# EAGLE design mbedXdotShield-V_1_0_1 (EAGLE 7.6.0)

## Sheet 1 of 5
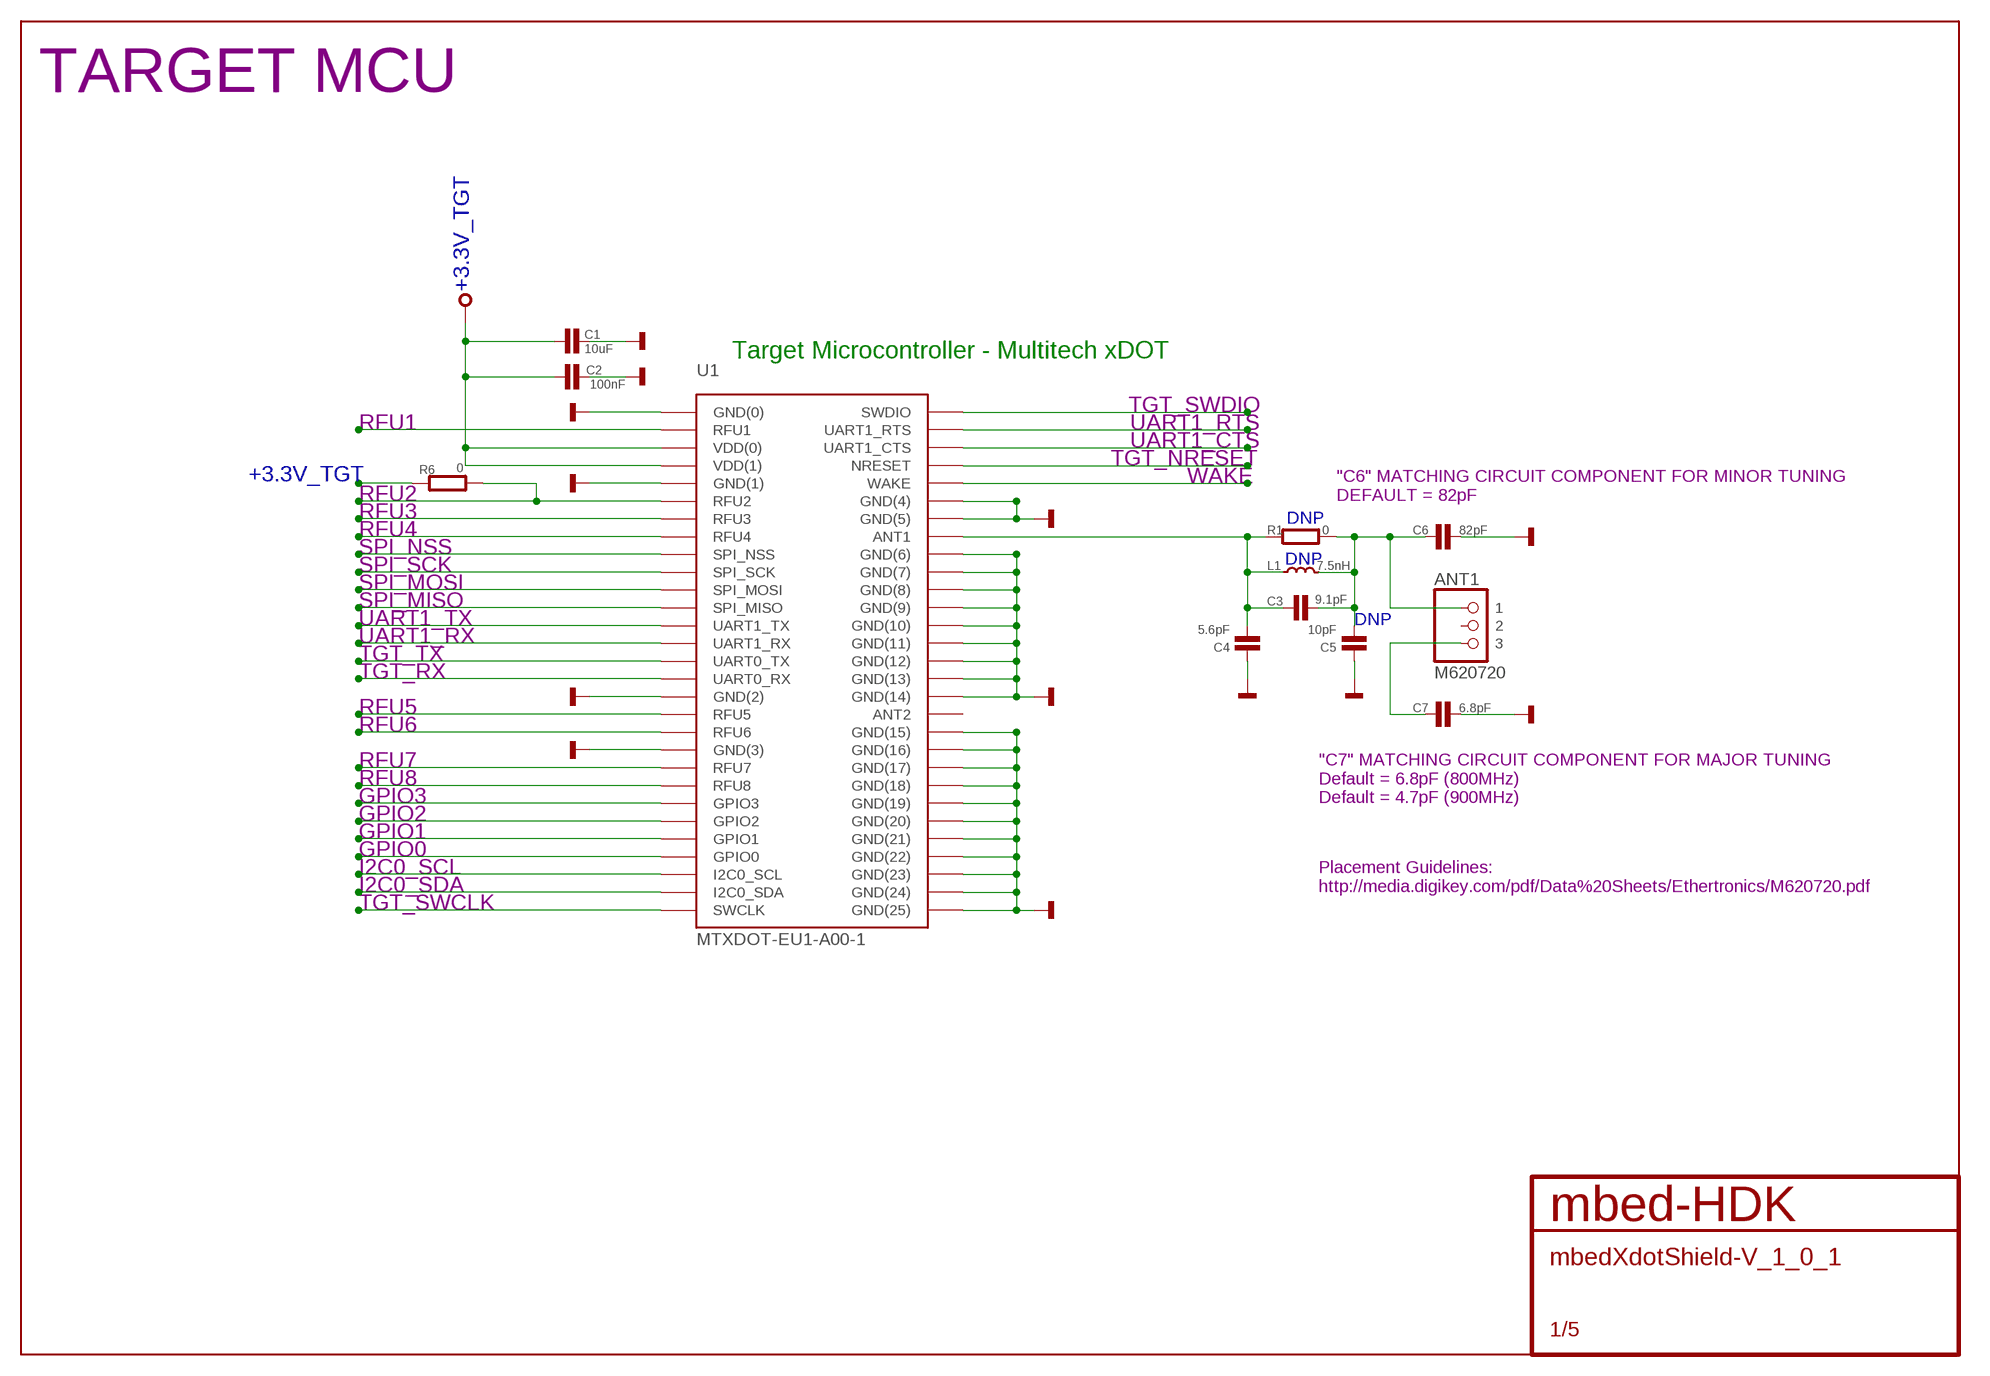
[diagram p0: schematic, sheet 1]

### Parts
ANT1  M620720  [M620720]
C1  10uF  CAPACITOR0603  [0603]
C2  100nF  CAPACITOR0603  [0603]
C3  9.1pF  CAPACITOR0402  [0402]
C4  5.6pF  CAPACITOR0402  [0402]
C5  10pF  CAPACITOR0402  [0402]
C6  82pF  CAPACITOR0402  [0402]
C7  6.8pF  CAPACITOR0402  [0402]
L1  7.5nH  INDUCTOR0402  [0402]
R1  0  RESISTOR0402  [0402]
R6  0  RESISTOR0402  [0402]
U1  MTXDOT-EU1-A00-1  [MTXDOT-EU1/NA1-A00-1]

### Nets
+3.3V_TGT: C1.1 C2.1 R6.1 U1.P$3(VDD(0)) U1.P$4(VDD(1)) ; also sheet 2,4,5
ANT1: C3.1 C4.2 L1.1 R1.1 U1.P$37(ANT1)
GND: C1.2 C2.2 C4.1 C5.1 C6.1 C7.1 U1.P$1(GND(0)) U1.P$5(GND(1)) U1.P$17(GND(2)) U1.P$20(GND(3)) U1.P$35(GND(4)) U1.P$36(GND(5)) U1.P$38(GND(6)) U1.P$39(GND(7)) U1.P$40(GND(8)) U1.P$41(GND(9)) U1.P$42(GND(10)) U1.P$43(GND(11)) U1.P$44(GND(12)) U1.P$45(GND(13)) U1.P$46(GND(14)) U1.P$48(GND(15)) U1.P$49(GND(16)) U1.P$50(GND(17)) U1.P$51(GND(18)) U1.P$52(GND(19)) U1.P$53(GND(20)) U1.P$54(GND(21)) U1.P$55(GND(22)) U1.P$56(GND(23)) U1.P$57(GND(24)) U1.P$58(GND(25)) ; also sheet 2,3,4,5
GPIO0: U1.P$26(GPIO0) ; also sheet 4
GPIO1: U1.P$25(GPIO1) ; also sheet 4
GPIO2: U1.P$24(GPIO2) ; also sheet 5
GPIO3: U1.P$23(GPIO3) ; also sheet 5
I2C0_SCL: U1.P$27(I2C0_SCL) ; also sheet 5
I2C0_SDA: U1.P$28(I2C0_SDA) ; also sheet 5
N$1: ANT1.P$3 C7.2
N$4: ANT1.P$1 C3.2 C5.2 C6.2 L1.2 R1.2
RFU1: U1.P$2(RFU1)
RFU2: R6.2 U1.P$6(RFU2)
RFU3: U1.P$7(RFU3)
RFU4: U1.P$8(RFU4)
RFU5: U1.P$18(RFU5)
RFU6: U1.P$19(RFU6)
RFU7: U1.P$21(RFU7)
RFU8: U1.P$22(RFU8)
SPI_MISO: U1.P$12(SPI_MISO) ; also sheet 4,5
SPI_MOSI: U1.P$11(SPI_MOSI) ; also sheet 4,5
SPI_NSS: U1.P$9(SPI_NSS) ; also sheet 4,5
SPI_SCK: U1.P$10(SPI_SCK) ; also sheet 4,5
TGT_NRESET: U1.P$33(NRESET) ; also sheet 3,5
TGT_RX: U1.P$16(UART0_RX) ; also sheet 3
TGT_SWCLK: U1.P$29(SWCLK) ; also sheet 3
TGT_SWDIO: U1.P$30(SWDIO) ; also sheet 3
TGT_TX: U1.P$15(UART0_TX) ; also sheet 3
UART1_CTS: U1.P$32(UART1_CTS) ; also sheet 5
UART1_RTS: U1.P$31(UART1_RTS) ; also sheet 5
UART1_RX: U1.P$14(UART1_RX) ; also sheet 5
UART1_TX: U1.P$13(UART1_TX) ; also sheet 5
WAKE: U1.P$34(WAKE) ; also sheet 5
Unconnected: ANT1.P$2 U1.P$47(ANT2)

### Notes on the sheet
- TARGET MCU
- Target Microcontroller - Multitech xDOT
- "C6" MATCHING CIRCUIT COMPONENT FOR MINOR TUNING
  DEFAULT = 82pF
- DNP
- DNP
- DNP
- "C7" MATCHING CIRCUIT COMPONENT FOR MAJOR TUNING
  Default = 6.8pF (800MHz)
  Default = 4.7pF (900MHz)
- Placement Guidelines:
  http://media.digikey.com/pdf/Data%20Sheets/Ethertronics/M620720.pdf

## Sheet 2 of 5
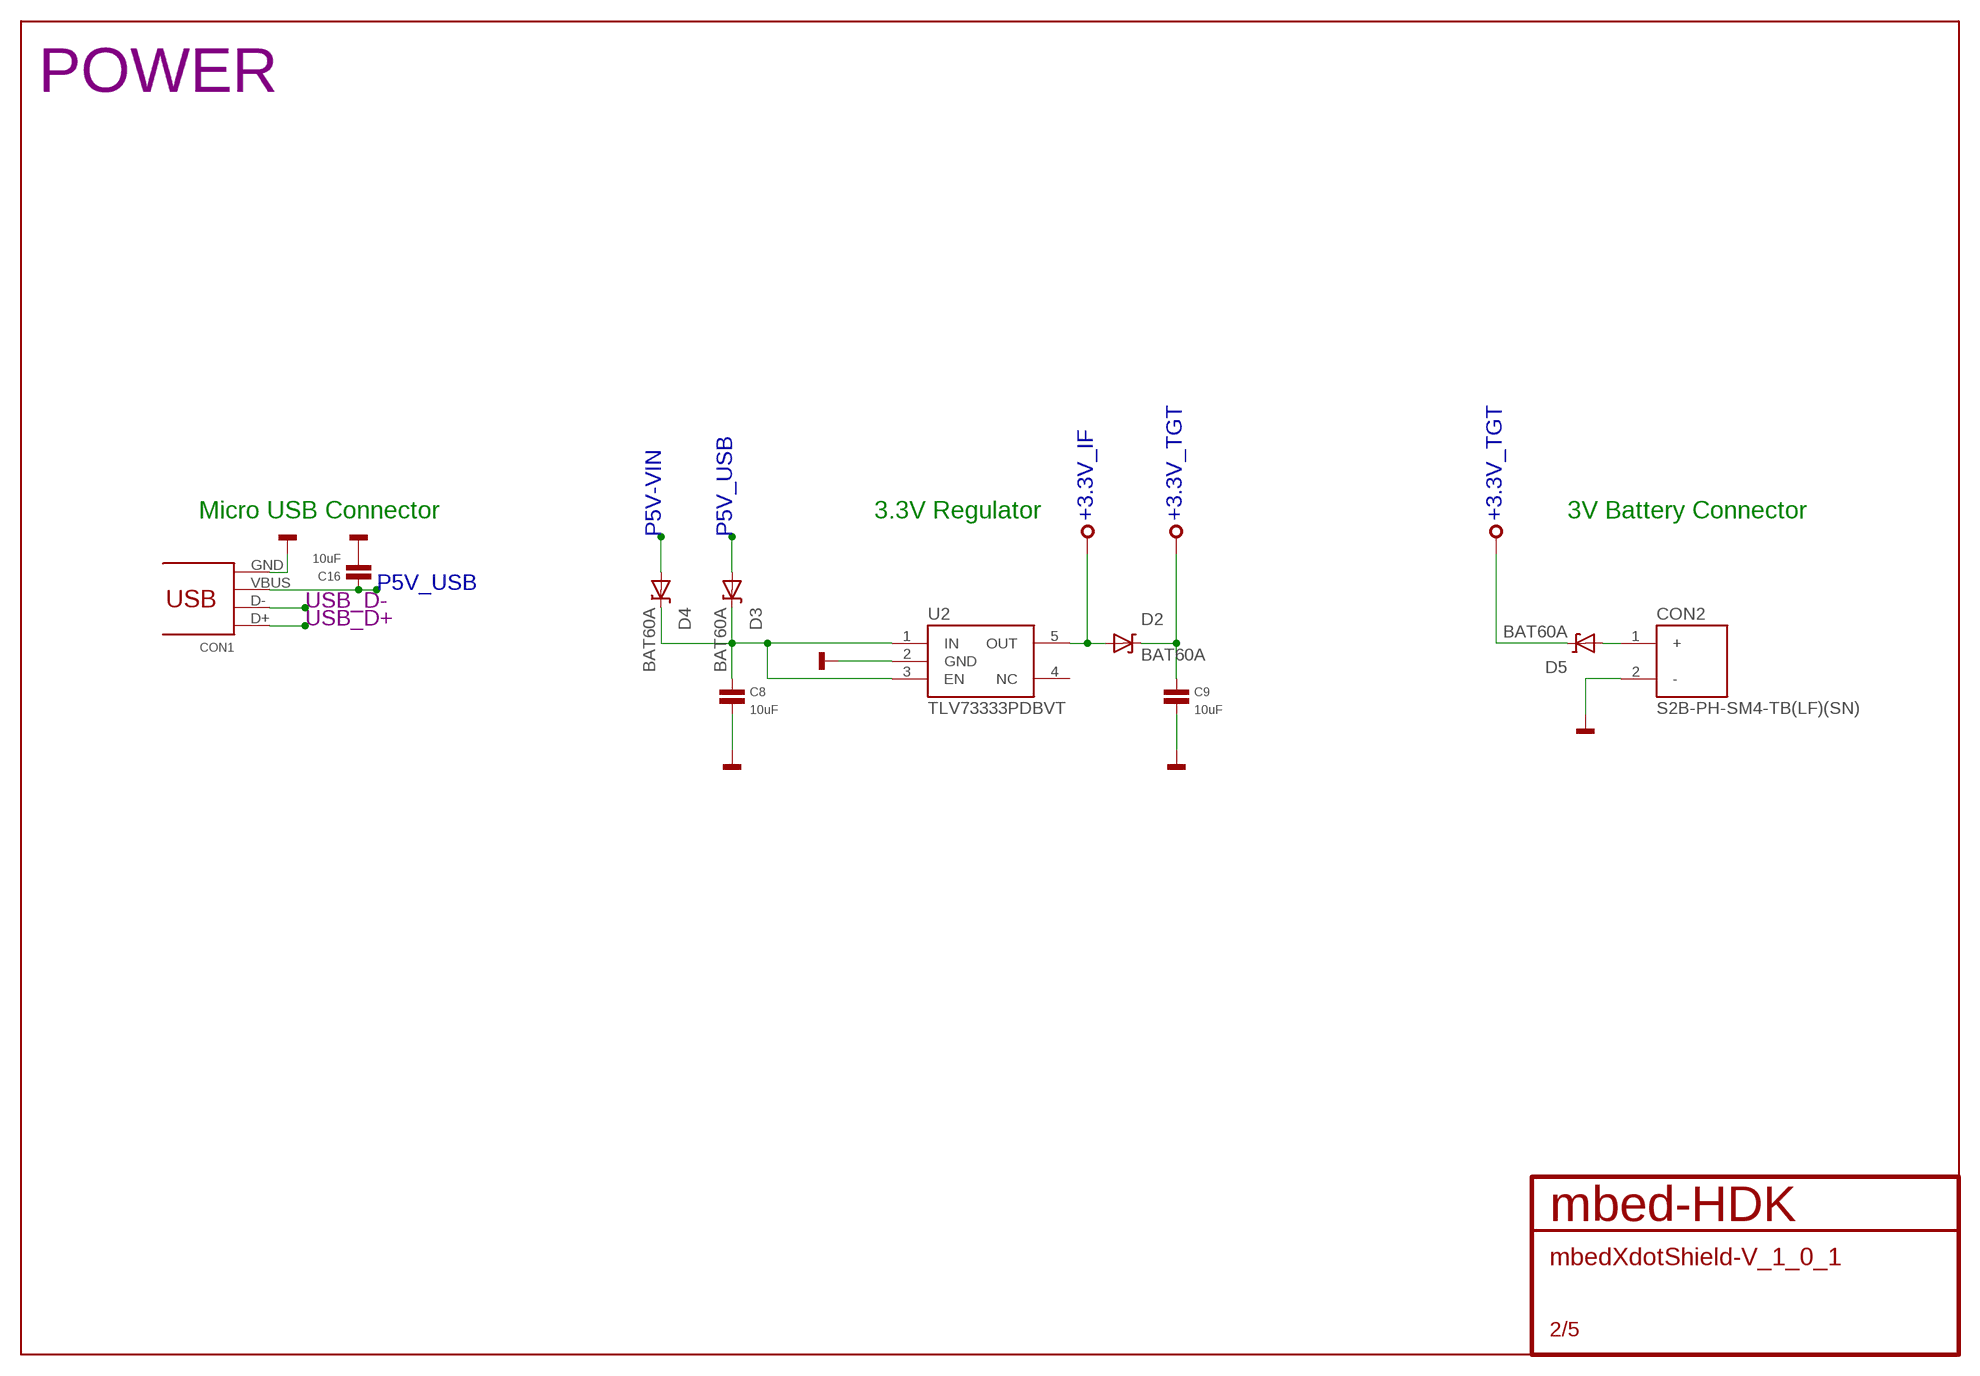
[diagram p1: schematic, sheet 2]

### Parts
C8  10uF  CAPACITOR0603  [0603]
C9  10uF  CAPACITOR0603  [0603]
C16  10uF  CAPACITOR0603  [0603]
CON1  47346-0001  [USB-MICRO-B-H]
CON2  S2B-PH-SM4-TB(LF)(SN)  [S2B-PH-SM4-TB(LF)(SN)]
D2  BAT60A  [SOD323]
D3  BAT60A  [SOD323]
D4  BAT60A  [SOD323]
D5  BAT60A  [SOD323]
U2  TLV73333PDBVT  [SOT23-5]

### Nets
+3.3V_IF: D2.A U2.5(OUT) ; also sheet 3
+3.3V_TGT: C9.1 D2.K D5.K ; also sheet 1,4,5
GND: C8.2 C9.2 C16.2 CON1.GND CON2.2(-) U2.2(GND) ; also sheet 1,3,4,5
N$25: C8.1 D3.K D4.K U2.1(IN) U2.3(EN)
N$47: CON2.1(+) D5.A
P5V-VIN: D4.A ; also sheet 5
P5V_USB: C16.1 CON1.VBUS D3.A ; also sheet 5
USB_D+: CON1.D+ ; also sheet 3
USB_D-: CON1.D- ; also sheet 3
Unconnected: U2.4(NC)

### Notes on the sheet
- POWER
- Micro USB Connector | 3.3V Regulator | 3V Battery Connector

## Sheet 3 of 5
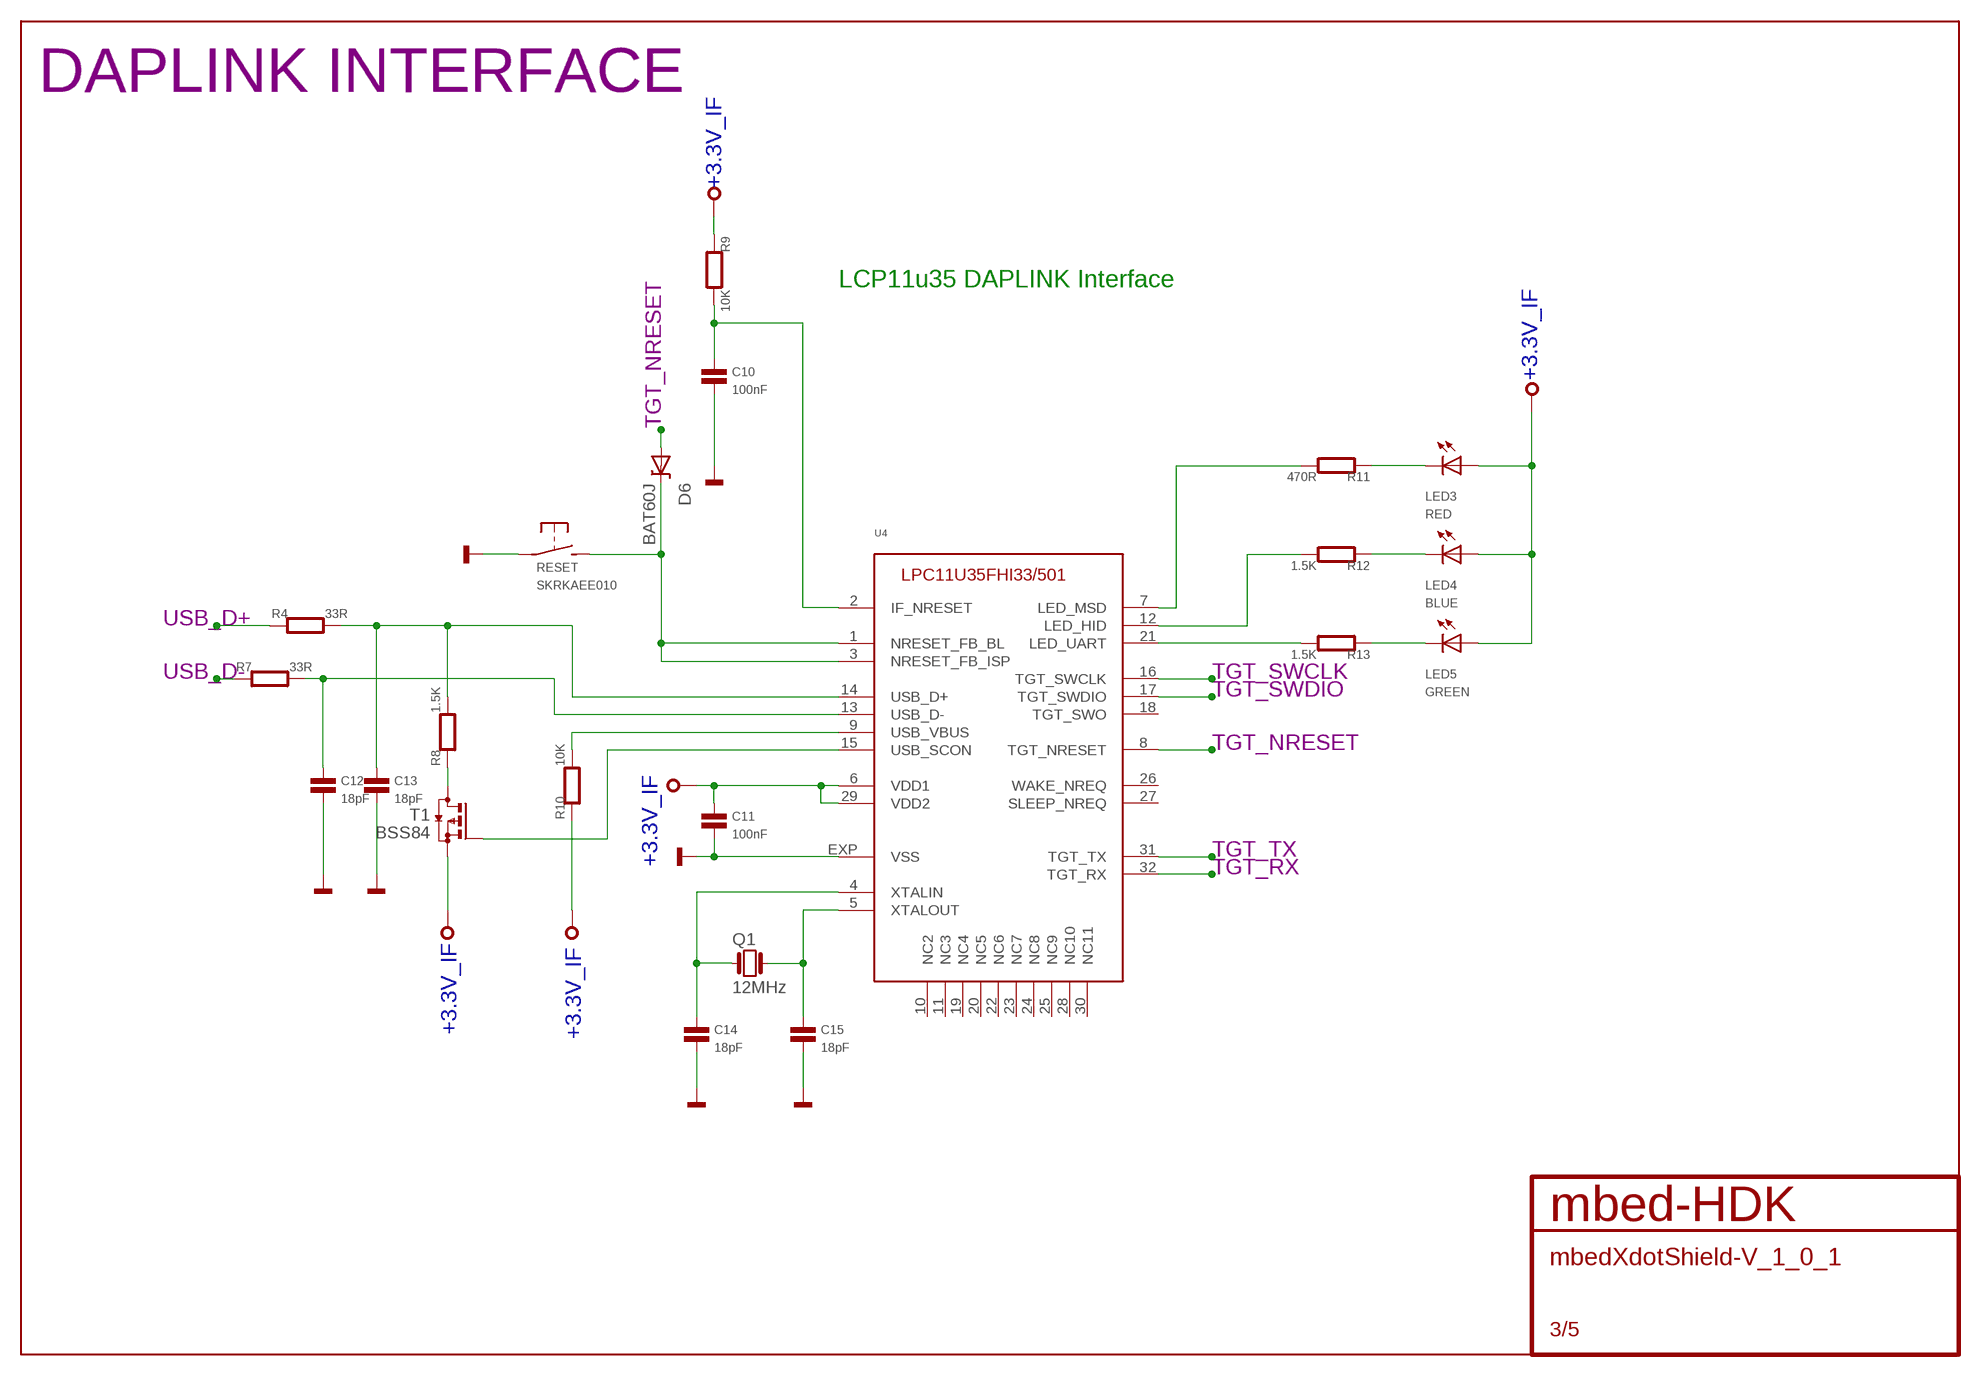
[diagram p2: schematic, sheet 3]

### Parts
C10  100nF  CAPACITOR0402  [0402]
C11  100nF  CAPACITOR0402  [0402]
C12  18pF  CAPACITOR0402  [0402]
C13  18pF  CAPACITOR0402  [0402]
C14  18pF  CAPACITOR0402  [0402]
C15  18pF  CAPACITOR0402  [0402]
D6  BAT60J  [SOD323]
LED3  RED  SMD_LED0603  [CHIPLED_0603]
LED4  BLUE  SMD_LED0603  [CHIPLED_0603]
LED5  GREEN  SMD_LED0603  [CHIPLED_0603]
Q1  12MHz  Q_3.2X2.5  [3.2X.2.5]
R4  33R  RESISTOR0402  [0402]
R7  33R  RESISTOR0402  [0402]
R8  1.5K  RESISTOR0402  [0402]
R9  10K  RESISTOR0402  [0402]
R10  10K  RESISTOR0402  [0402]
R11  470R  RESISTOR0402  [0402]
R12  1.5K  RESISTOR0402  [0402]
R13  1.5K  RESISTOR0402  [0402]
RESET  SKRKAEE010  [SKRKAEE010]
T1  BSS84  [SOT23-3]
U4  IF-LPC11U35  [HVQFN33]

### Nets
+3.3V_IF: C11.1 LED3.A LED4.A LED5.A R9.1 R10.1 T1.2(S) U4.6(VDD1) U4.29(VDD2) ; also sheet 2
GND: C10.2 C11.2 C12.2 C13.2 C14.2 C15.2 RESET.P$1(P) U4.EXP(VSS) ; also sheet 1,2,4,5
HID: R12.2 U4.12(LED_HID)
IF_NRESET: C10.1 R9.2 U4.2(IF_NRESET)
ISP: D6.K RESET.P$2(S) U4.1(NRESET_FB_BL) U4.3(NRESET_FB_ISP)
MSD: R11.2 U4.7(LED_MSD)
N$21: C13.1 R4.2 R8.2 U4.14(USB_D+)
N$24: C12.1 R7.2 U4.13(USB_D-)
N$26: T1.1(G) U4.15(USB_SCON)
N$27: R8.1 T1.3(D)
N$28: R10.2 U4.9(USB_VBUS)
N$34: LED3.C R11.1
N$35: LED4.C R12.1
N$36: LED5.C R13.1
N$37: C15.1 Q1.P$3 U4.5(XTALOUT)
N$40: C14.1 Q1.P$1 U4.4(XTALIN)
TGT_NRESET: D6.A U4.8(TGT_NRESET) ; also sheet 1,5
TGT_RX: U4.32(TGT_RX) ; also sheet 1
TGT_SWCLK: U4.16(TGT_SWCLK) ; also sheet 1
TGT_SWDIO: U4.17(TGT_SWDIO) ; also sheet 1
TGT_TX: U4.31(TGT_TX) ; also sheet 1
UART: R13.2 U4.21(LED_UART)
USB_D+: R4.1 ; also sheet 2
USB_D-: R7.1 ; also sheet 2
Unconnected: U4.10(NC2) U4.11(NC3) U4.18(TGT_SWO) U4.19(NC4) U4.20(NC5) U4.22(NC6) U4.23(NC7) U4.24(NC8) U4.25(NC9) U4.26(WAKE_NREQ) U4.27(SLEEP_NREQ) U4.28(NC10) U4.30(NC11)

### Notes on the sheet
- DAPLINK INTERFACE
- LCP11u35 DAPLINK Interface

## Sheet 4 of 5
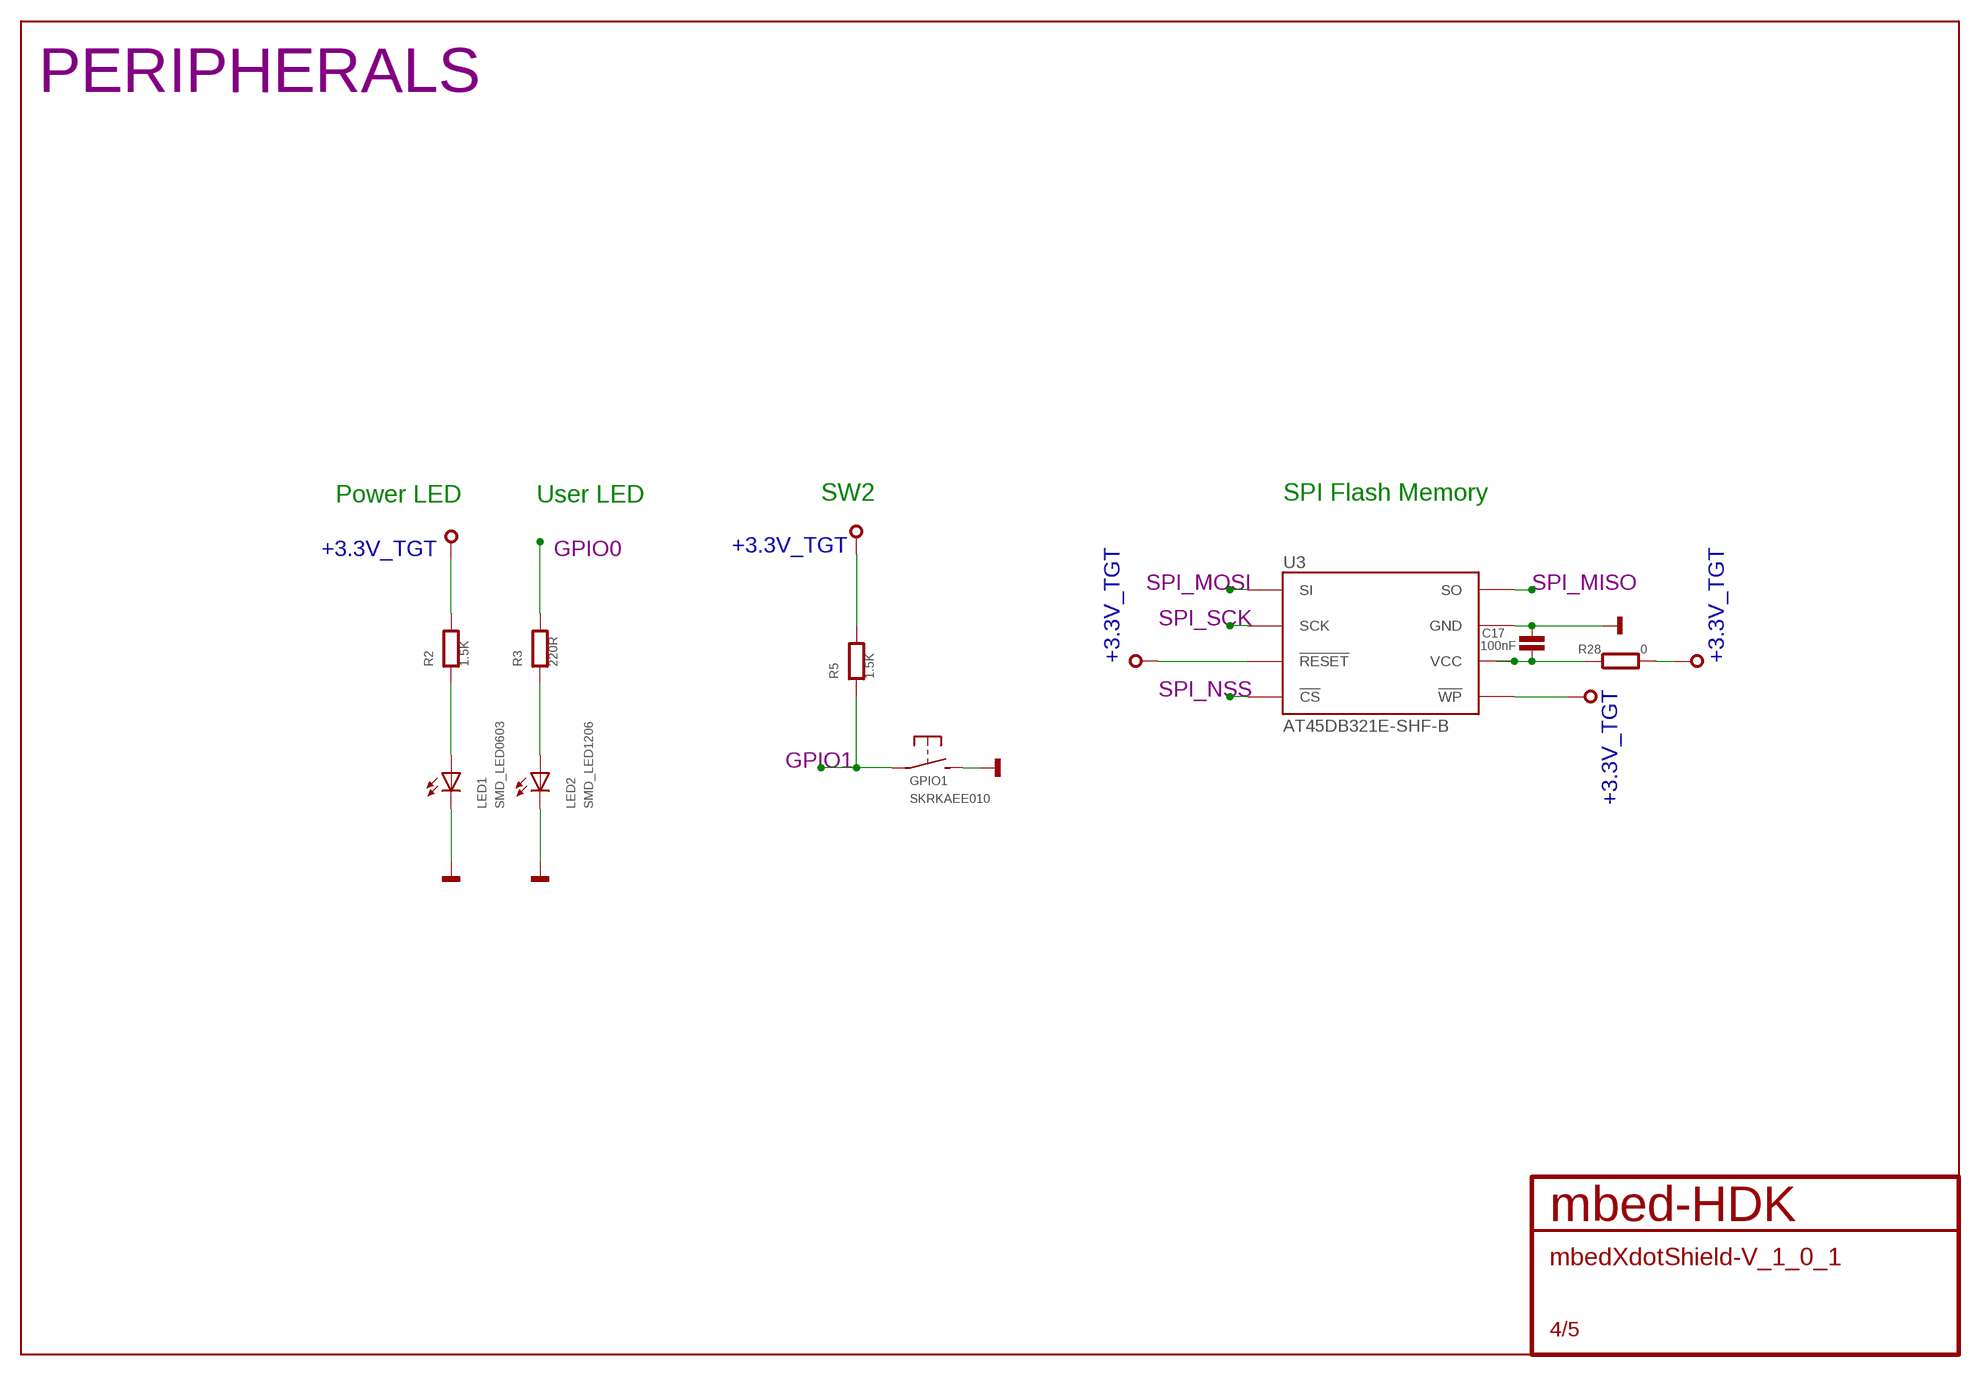
[diagram p3: schematic, sheet 4]

### Parts
C17  100nF  CAPACITOR0603  [0603]
GPIO1  SKRKAEE010  [SKRKAEE010]
LED1  SMD_LED0603  [CHIPLED_0603]
LED2  SMD_LED1206  [CHIPLED_1206]
R2  1.5K  RESISTOR0402  [0402]
R3  220R  RESISTOR0402  [0402]
R5  1.5K  RESISTOR0402  [0402]
R28  0  RESISTOR0402  [0402]
U3  AT45DB321E-SHF-B  [SO8]

### Nets
+3.3V_TGT: R2.2 R5.2 R28.2 U3.3(!RESET) U3.5(!WP) ; also sheet 1,2,5
GND: C17.1 GPIO1.P$2(S) LED1.C LED2.C U3.7(GND) ; also sheet 1,2,3,5
GPIO0: R3.2 ; also sheet 1
GPIO1: GPIO1.P$1(P) R5.1 ; also sheet 1
N$22: LED2.A R3.1
N$23: LED1.A R2.1
N$48: C17.2 R28.1 U3.6(VCC)
SPI_MISO: U3.8(SO) ; also sheet 1,5
SPI_MOSI: U3.1(SI) ; also sheet 1,5
SPI_NSS: U3.4(!CS) ; also sheet 1,5
SPI_SCK: U3.2(SCK) ; also sheet 1,5

### Notes on the sheet
- PERIPHERALS
- Power LED | User LED | SW2 | SPI Flash Memory

## Sheet 5 of 5
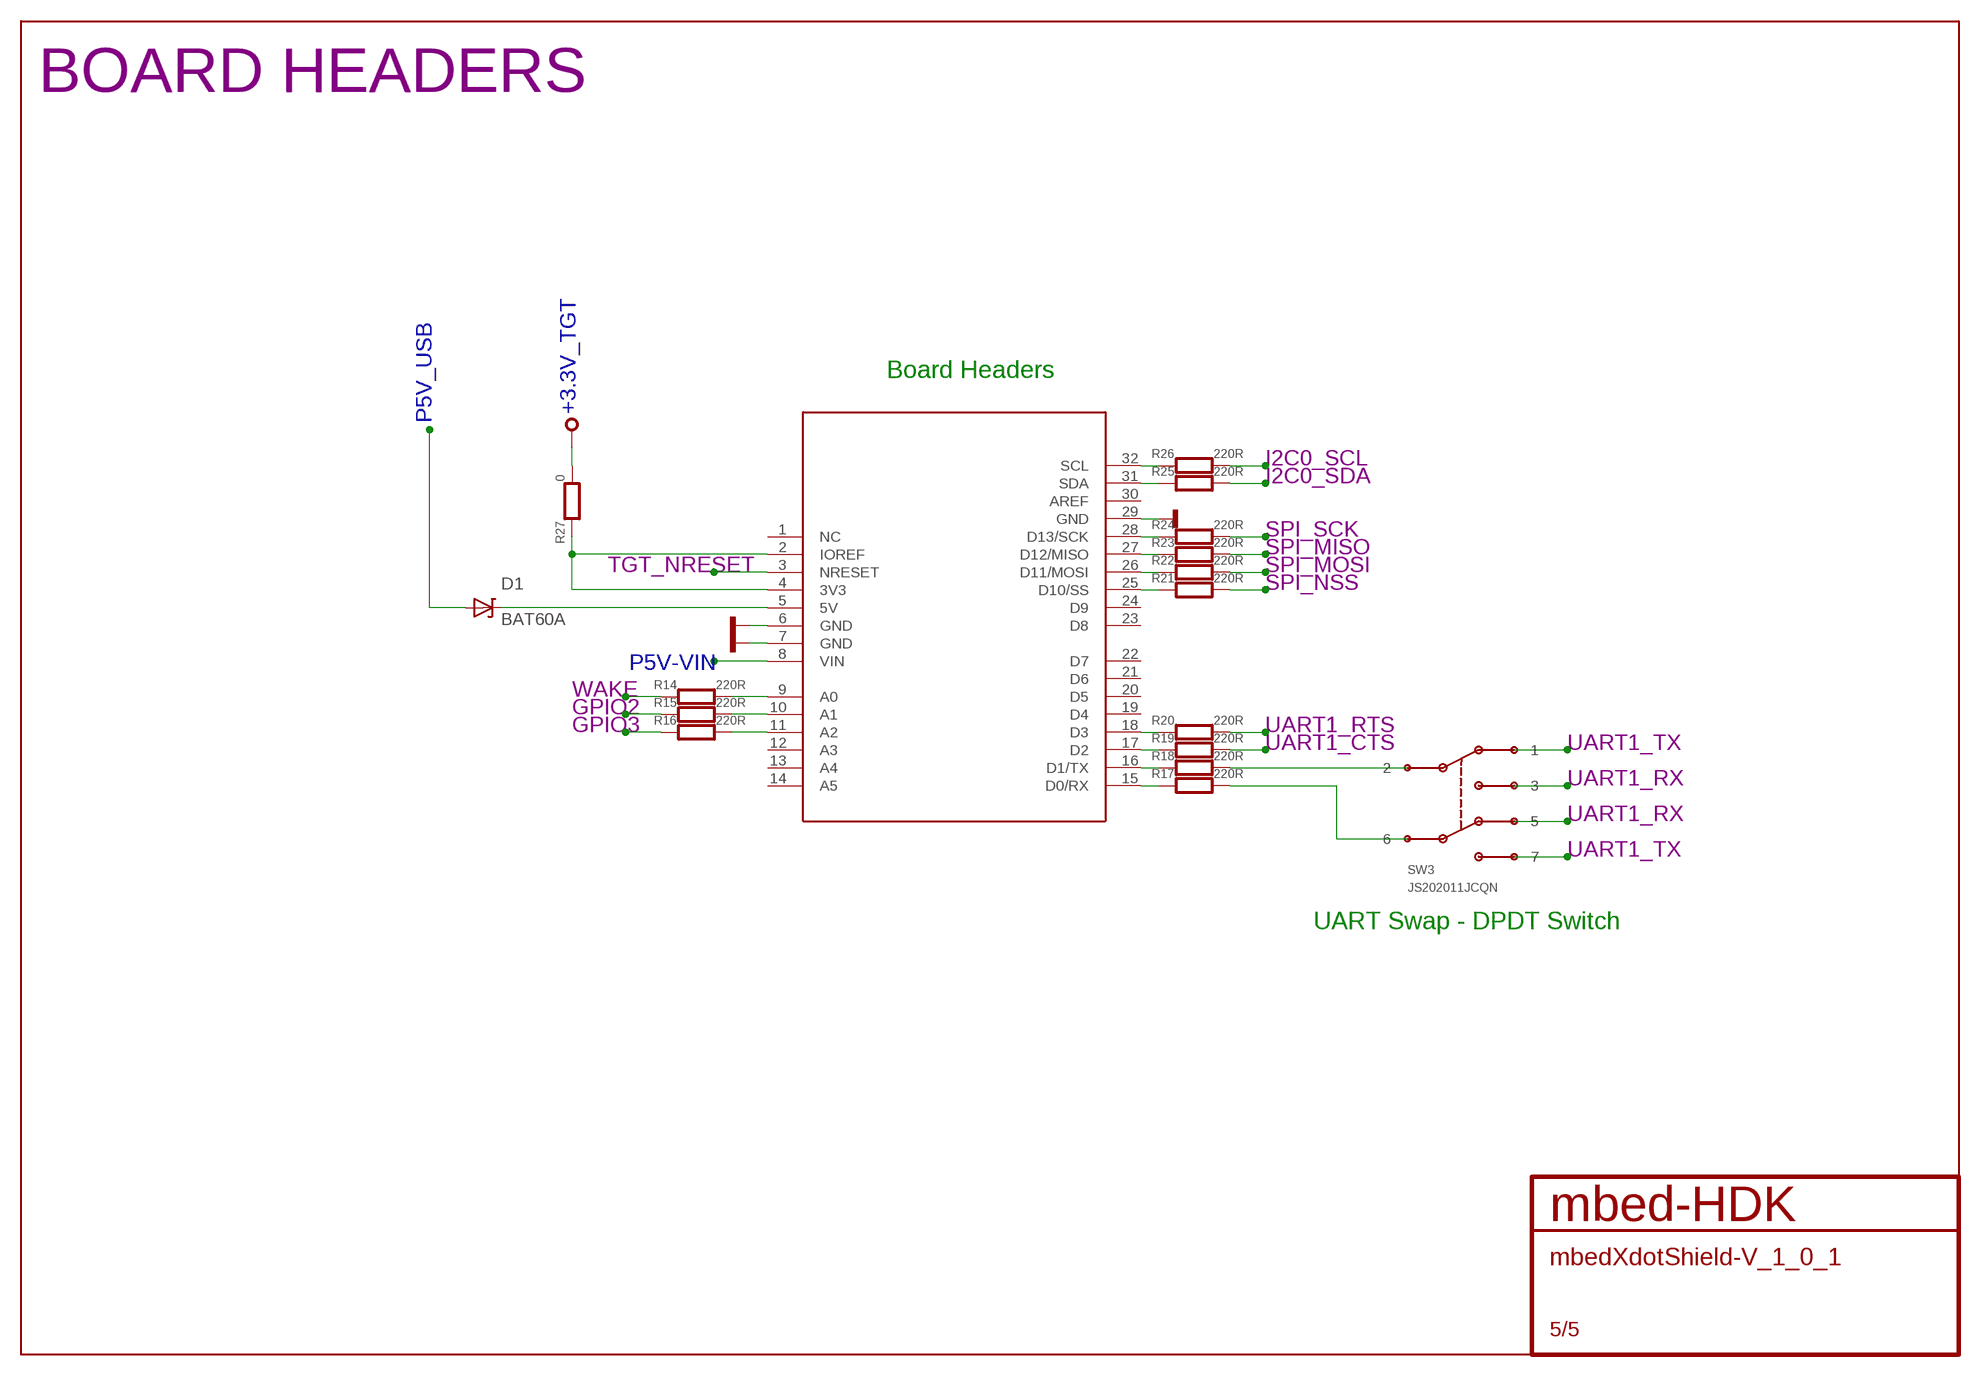
[diagram p4: schematic, sheet 5]

### Parts
BRD1  K64F/K22F-SHIELD  [K64F/K22F]
D1  BAT60A  [SOD323]
R14  220R  RESISTOR0402  [0402]
R15  220R  RESISTOR0402  [0402]
R16  220R  RESISTOR0402  [0402]
R17  220R  RESISTOR0402  [0402]
R18  220R  RESISTOR0402  [0402]
R19  220R  RESISTOR0402  [0402]
R20  220R  RESISTOR0402  [0402]
R21  220R  RESISTOR0402  [0402]
R22  220R  RESISTOR0402  [0402]
R23  220R  RESISTOR0402  [0402]
R24  220R  RESISTOR0402  [0402]
R25  220R  RESISTOR0402  [0402]
R26  220R  RESISTOR0402  [0402]
R27  0  RESISTOR0402  [0402]
SW3  JS202011JCQN  [JS202011JCQN]

### Nets
+3.3V_TGT: R27.2 ; also sheet 1,2,4
GND: BRD1.6(GND) BRD1.7(GND) BRD1.29(GND) ; also sheet 1,2,3,4
GPIO2: R15.1 ; also sheet 1
GPIO3: R16.1 ; also sheet 1
I2C0_SCL: R26.2 ; also sheet 1
I2C0_SDA: R25.2 ; also sheet 1
N$20: BRD1.9(A0) R14.2
N$29: BRD1.10(A1) R15.2
N$30: BRD1.11(A2) R16.2
N$31: BRD1.15(D0/RX) R17.1
N$32: BRD1.16(D1/TX) R18.1
N$33: BRD1.17(D2) R19.1
N$38: BRD1.5(5V) D1.K
N$39: BRD1.18(D3) R20.1
N$41: BRD1.25(D10/SS) R21.1
N$42: BRD1.26(D11/MOSI) R22.1
N$43: BRD1.27(D12/MISO) R23.1
N$44: BRD1.28(D13/SCK) R24.1
N$45: BRD1.31(SDA) R25.1
N$46: BRD1.32(SCL) R26.1
N$49: BRD1.2(IOREF) BRD1.4(3V3) R27.1
N$50: R17.2 SW3.6
N$51: R18.2 SW3.2
P5V-VIN: BRD1.8(VIN) ; also sheet 2
P5V_USB: D1.A ; also sheet 2
SPI_MISO: R23.2 ; also sheet 1,4
SPI_MOSI: R22.2 ; also sheet 1,4
SPI_NSS: R21.2 ; also sheet 1,4
SPI_SCK: R24.2 ; also sheet 1,4
TGT_NRESET: BRD1.3(NRESET) ; also sheet 1,3
UART1_CTS: R19.2 ; also sheet 1
UART1_RTS: R20.2 ; also sheet 1
UART1_RX: SW3.3 SW3.5 ; also sheet 1
UART1_TX: SW3.1 SW3.7 ; also sheet 1
WAKE: R14.1 ; also sheet 1
Unconnected: BRD1.1(NC) BRD1.12(A3) BRD1.13(A4) BRD1.14(A5) BRD1.19(D4) BRD1.20(D5) BRD1.21(D6) BRD1.22(D7) BRD1.23(D8) BRD1.24(D9) BRD1.30(AREF)

### Notes on the sheet
- BOARD HEADERS
- Board Headers
- UART Swap - DPDT Switch

## Library data of the parts
ANT1 = mbed-HDK-RF:M620720: Chip Antenna Ceramic ISM/M2M/IoT 868/915MHz; MF: Ethertronics; MFN: M620720; OC-DIGIKEY: 939-1066-1-ND
BRD1 = mbed-HDK-misc-Board:K64F/K22F-SHIELD: Shield for K64F/K22F
C1-C17 = mbed-HDK-RLCQ:CAPACITOR: Capacitor
CON1 = mbed-HDK-Connector:47346-0001: USB Receptacle Horizontal Micro Type B; MF: MOLEX; MFN: 47346-0001; OC-MOUSER: 538-47346-0001; OC-NEWARK: 1568026
CON2 = mbed-HDK-Connector:S2B-PH-SM4-TB(LF)(SN): 2 Position 2 mm JST PH Series Pitch Surface Mount Side Entry Shrouded Header; MF: JST; MFN: S2B-PH-SM4-TB(LF)(SN); OC-DIGIKEY: 455-1749-1-ND; OC-NEWARK: 38K8067
D1-D5 = mbed-HDK-Transistor:BAT60A: SCHOTTKY DIODE; MF: Infineon; MFN: BAT60AE6327HTSA1; OC-DIGIKEY: BAT60AE6327HTSA1CT-ND; OC-MOUSER: 726-BAT60AE6327; OC-NEWARK: 85X4127
D6 = mbed-HDK-Transistor:BAT60J: SCHOTTKY DIODE; MF: STMicroelectronics; MFN: BAT60JFILM; OC-DIGIKEY: 497-3707-6-ND; OC-MOUSER: 511-BAT60JFILM; OC-NEWARK: 89K1218
GPIO1 RESET = mbed-HDK-Switch:SKRKAEE010: MOMENTARY SWITCH PUSH VERTICAL (SPST); MF: ALPS; MFN: SKRKAEE010; OC-MOUSER: 688-SKRKAE
L1 = mbed-HDK-RLCQ:INDUCTOR: Inductor
LED1 LED3-LED5 = mbed-HDK-Optical:SMD_LED: LED SMD, Colour Red; MF: Wurth Electronics Inc; MFN: 150060RS75000; OC-DIGIKEY: 732-4978-1-ND; OC-MOUSER: 710-150060RS75000; OC-NEWARK: 2322071
LED2 = mbed-HDK-Optical:SMD_LED: LED SMD, Colour Red; MF: Wurth Electronics Inc; MFN: 150120GS75000; OC-DIGIKEY: 732-4990-1-ND; OC-MOUSER: 710-150120GS75000; OC-NEWARK: 2322085
Q1 = mbed-HDK:Q
R1-R28 = mbed-HDK-RLCQ:RESISTOR: Resistor
SW3 = mbed-HDK-Switch:JS202011JCQN: SLIDE TOGGLE SWITCH VERTICAL (DPDT); MF: C&K Components; MFN: JS202011JCQN; OC-DIGIKEY: CKN10723CT-ND; OC-MOUSER: 611-JS202011JCQN
T1 = mbed-HDK-Transistor:BSS84: MOSFET P-CHANNEL; MF: Fairchild Semiconductor; MFN: BSS84; OC-DIGIKEY: BSS84CT-ND; OC-MOUSER: 512-BSS84; OC-NEWARK: 58K8770
U1 = mbed-HDK-MF-MULTITECH:MTXDOT-EU1-A00-1: Multitech xDOT LORA MODULE UFL/TRC 868MHz for Europe; MF: Multi-Tech Systems Inc.; MFN: MTXDOT-EU1-A00-1; OC-DIGIKEY: 591-1292-ND
U2 = mbed-HDK-Power:TLV73333PDBVT: LDO Fixed Regulator 3.3v, 300mA; MF: Texas Instruments; MFN: TLV73333PDBVT; OC-DIGIKEY: 296-38492-1-ND; OC-MOUSER: 595-TLV73333PDBVT; OC-NEWARK: 2455145
U3 = mbed-HDK-IC:AT45DB321E-SHF-B: Serial Flash 32 Mb 85 Mhz; MF: Adesto Technologies; MFN: AT45DB321E-SHF-B; OC-DIGIKEY: 1265-1072-5-ND; OC-MOUSER: 988-AT45DB321E-SHF-B; OC-NEWARK: 2414318
U4 = mbed-HDK:IF-LPC11U35

## Board
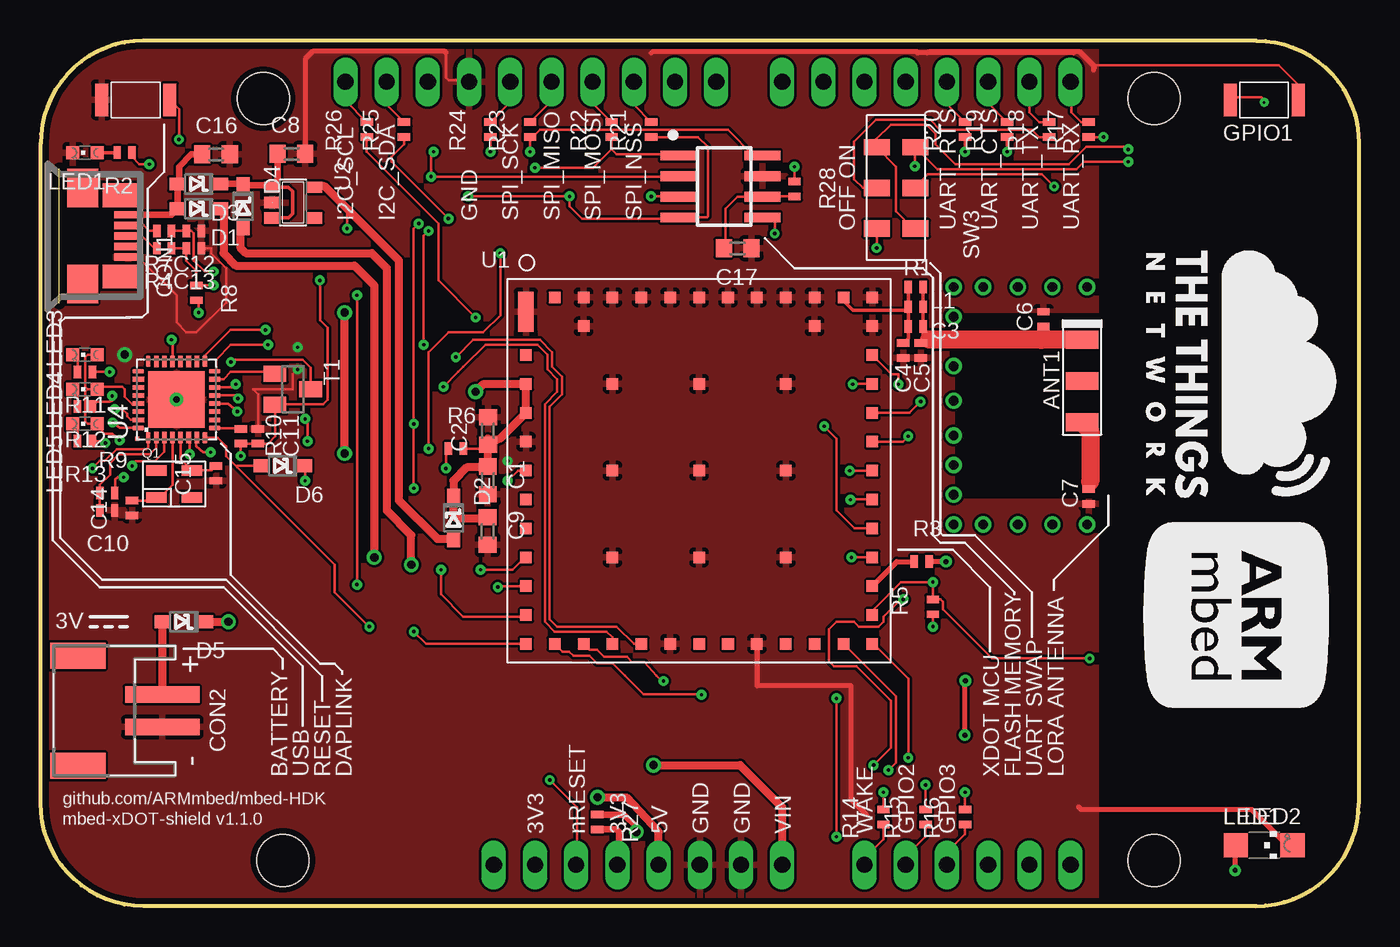
[diagram p5: board, top side]
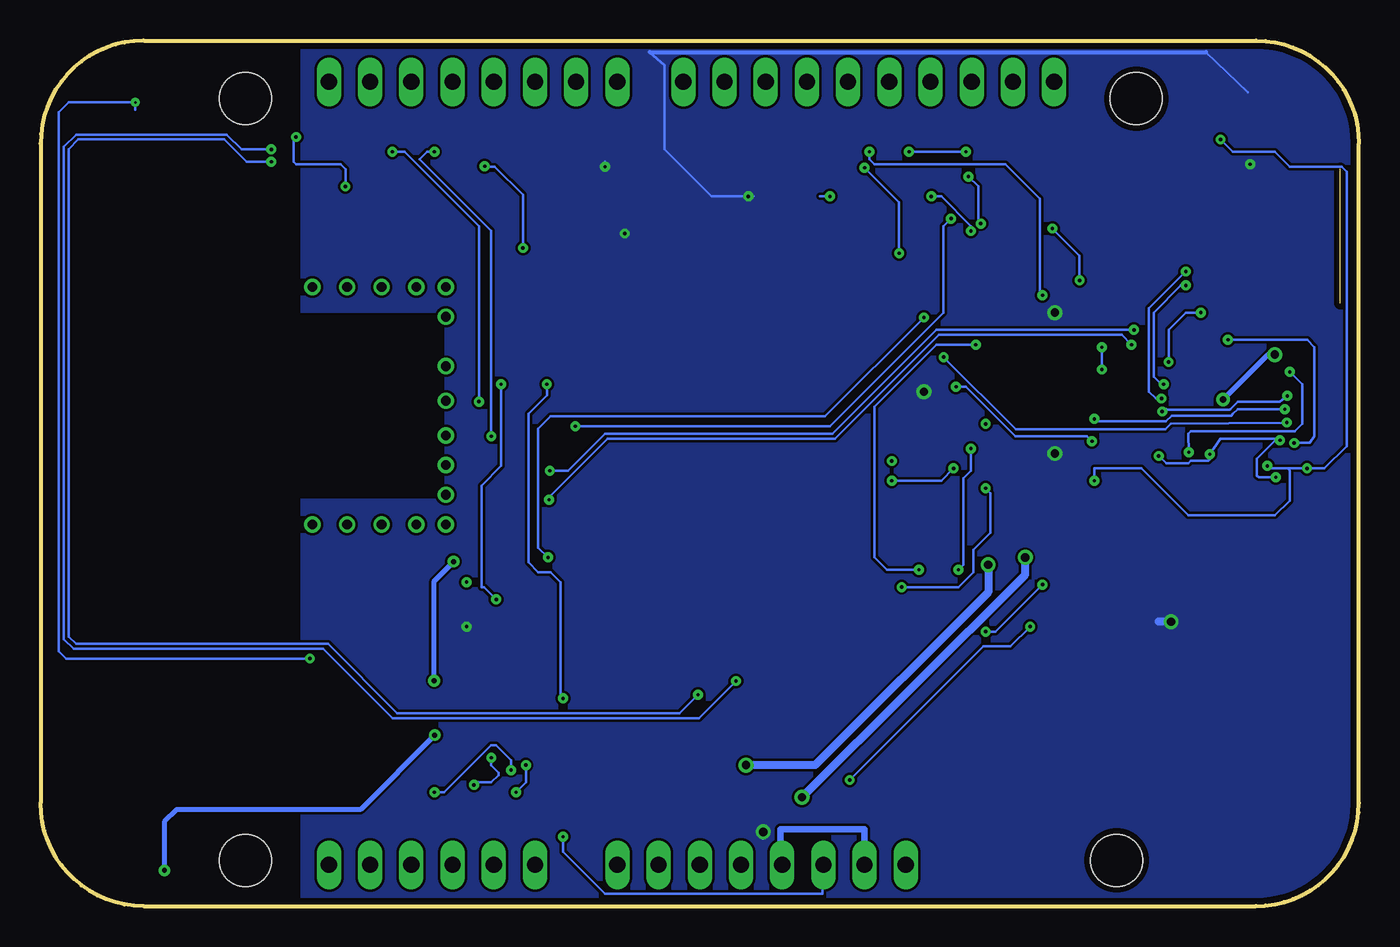
[diagram p6: board, bottom side, seen from below]

Size 81.28 x 53.34 mm. Coordinates in mm from the lower left corner, seen from the top.
Copper layers ((1*16)): Top 0.035mm / dielectric 0.8mm / Bottom 0.035mm
Design rules "mbed-HDK-6-6-2-layer": minimum track width 6mil, minimum drill 9mil, track to track 6mil, track to pad 6mil, pad to pad 6mil, via to via 6mil, smd to smd 6mil, copper to edge 15mil, drill to drill 8mil, minimum pad ring 10mil, minimum via ring 8mil, stop-mask expansion 4mil, vias tented up to drill 0mil, thermal gap 10mil
tRestrict: area 56.4,25.1 to 65.5,36.5
bRestrict: area 56.4,25.1 to 65.5,36.5

### Footprints (pad centres in the part's own frame; a part is rotated, then mirrored left to right if it is on the bottom)
M620720 = smd 1.1 x 2: P$1 -2.55,0; P$2 0,0; P$3 2.55,0
K64F/K22F = drill 1 long: 1 27.94,2.54; 2 30.48,2.54; 3 33.02,2.54; 4 35.56,2.54; 5 38.1,2.54; 6 40.64,2.54; 7 43.18,2.54; 8 45.72,2.54; 9 50.8,2.54; 10 53.34,2.54; 11 55.88,2.54; 12 58.42,2.54; 13 60.96,2.54; 14 63.5,2.54; 15 63.5,50.8; 16 60.96,50.8; 17 58.42,50.8; 18 55.88,50.8; 19 53.34,50.8; 20 50.8,50.8; 21 48.26,50.8; 22 45.72,50.8; 23 41.656,50.8; 24 39.116,50.8; 25 36.576,50.8; 26 34.036,50.8; 27 31.496,50.8; 28 28.956,50.8; 29 26.416,50.8; 30 23.876,50.8; 31 21.336,50.8; 32 18.796,50.8 | hole 3.2: 13.729,49.759; 14.948,2.819; 68.656,2.819; 68.656,49.759
0603 = smd 1 x 1.1: 1 -0.85,0; 2 0.85,0
0402 = smd 0.457 x 0.762: 1 -0.457,0; 2 0.457,0
USB-MICRO-B-H = smd 1.7 x 0.45: 4 2.8,-0.65; D+ 2.8,0; D- 2.8,0.65; GND 2.8,-1.3; VBUS 2.8,1.3 | smd 1.9 x 2.375: GND1 0,2.95; GND4 0,-2.95 | smd 2.1 x 1.475: GND2 2.3,2.5; GND3 2.3,-2.5
S2B-PH-SM4-TB(LF)(SN) = smd 1 x 4.6: 1 1,-3.7; 2 -1,-3.7 | smd 1.6 x 3.4: NC1 -3.4,1.5; NC2 3.4,1.5
SOD323 = smd 1 x 0.8: A 1.3,0; K -1.3,0
SKRKAEE010 = smd 0.8 x 2: P$1 -2.1,0; P$2 2.1,0
CHIPLED_0603 = smd 0.8 x 0.8: A 0,-0.75; C 0,0.75
CHIPLED_1206 = smd 1.5 x 1.5: A 0,-1.75; C 0,1.75
3.2X.2.5 = smd 1.27 x 0.635: P$1 -1.092,-0.838; P$2 1.092,-0.838; P$3 1.092,0.838; P$4 -1.092,0.838
JS202011JCQN = smd 1 x 1.6: 1 0,2.4; 2 2.5,2.4; 3 5,2.4; 5 0,0; 6 2.5,0; 7 5,0
SOT23-3 = smd 1 x 1.4: 1 -0.95,-1.1; 2 0.95,-1.1; 3 0,1.1
MTXDOT-EU1/NA1-A00-1 = smd 0.97 x 2.49: P$1 0,0 | smd 0.71 x 0.71: P$2 0,-2.67; P$3 0,-4.45; P$4 0,-6.23; P$5 0,-8.01; P$6 0,-9.79; P$7 0,-11.57; P$8 0,-13.35; P$9 0,-15.13; P$10 0,-16.91; P$11 0,-18.69; P$12 0,-20.47; P$13 1.78,-20.47; P$14 3.56,-20.47; P$15 5.34,-20.47; P$16 7.12,-20.47; P$17 8.9,-20.47; P$18 10.68,-20.47; P$19 12.46,-20.47; P$20 14.24,-20.47; P$21 16.02,-20.47; P$22 17.8,-20.47; P$23 19.58,-20.47; P$24 21.36,-20.47; P$25 21.36,-18.69; P$26 21.36,-16.91; P$27 21.36,-15.13; P$28 21.36,-13.35; P$29 21.36,-11.57; P$30 21.36,-9.79; P$31 21.36,-8.01; P$32 21.36,-6.23; P$33 21.36,-4.45; P$34 21.36,-2.67; P$35 21.36,-0.89; P$36 21.36,0.89; P$37 19.58,0.89; P$38 17.8,0.89; P$39 16.02,0.89; P$40 14.24,0.89; P$41 12.46,0.89; P$42 10.68,0.89; P$43 8.9,0.89; P$44 7.12,0.89; P$45 5.34,0.89; P$46 3.56,0.89; P$47 1.78,0.89; P$48 17.8,-0.89; P$49 3.56,-0.89; P$50 5.34,-4.45; P$51 10.68,-4.45; P$52 16.02,-4.45; P$53 5.34,-9.79; P$54 10.68,-9.79; P$55 16.02,-9.79; P$56 5.34,-15.13; P$57 10.68,-15.13; P$58 16.02,-15.13
SOT23-5 = smd 0.69 x 0.99: 1 -0.95,-1.29; 2 0,-1.29; 3 0.95,-1.29; 4 0.95,1.3; 5 -0.95,1.3
SO8 = smd 0.6 x 2.2: 1 -1.905,-2.6; 2 -0.635,-2.6; 3 0.635,-2.6; 4 1.905,-2.6; 5 1.905,2.6; 6 0.635,2.6; 7 -0.635,2.6; 8 -1.905,2.6
HVQFN33 = smd 0.7 x 0.28: 1 -2.35,1.75; 2 -2.35,1.25; 3 -2.35,0.75; 4 -2.35,0.25; 5 -2.35,-0.25; 6 -2.35,-0.75; 7 -2.35,-1.25; 8 -2.35,-1.75; 17 2.35,-1.75; 18 2.35,-1.25; 19 2.35,-0.75; 20 2.35,-0.25; 21 2.35,0.25; 22 2.35,0.75; 23 2.35,1.25; 24 2.35,1.75 | smd 0.28 x 0.7: 9 -1.75,-2.35; 10 -1.25,-2.35; 11 -0.75,-2.35; 12 -0.25,-2.35; 13 0.25,-2.35; 14 0.75,-2.35; 15 1.25,-2.35; 16 1.75,-2.35; 25 1.75,2.35; 26 1.25,2.35; 27 0.75,2.35; 28 0.25,2.35; 29 -0.25,2.35; 30 -0.75,2.35; 31 -1.25,2.35; 32 -1.75,2.35 | smd 3.5 x 3.5: EXP 0,0 | smd 0.25 x 0.25: M1 -2.415,2.415

### Placement (x,y rotation side)
ANT1  64.21,32.36 270 top
BRD1  0,0 0 top
C1  27.57,26.24 270 top
C2  27.58,29.28 90 top
C3  53.95,35.71 0 top
C4  53.19,34.24 90 top
C5  54.27,34.24 90 top
C6  61.82,36.17 270 top
C7  64.62,25.25 90 top
C8  15.47,46.36 0 top
C9  27.56,23.11 270 top
C10  4.11,24.38 0 top
C11  13.41,28.96 90 top
C12  9.45,41.61 0 top
C13  9.45,40.54 0 top
C14  5.64,24.54 270 top
C15  10.82,26.67 270 top
C16  10.82,46.33 0 top
C17  42.98,40.54 180 top
CON1  2.59,41.3 0 top
CON2  3.81,12.04 90 top
D1  9.75,42.98 180 top
D2  25.45,23.93 270 top
D3  9.75,44.5 180 top
D4  12.5,43.13 270 top
D5  8.84,17.53 180 top
D6  14.94,27.13 180 top
GPIO1  75.44,49.68 0 top
L1  53.95,36.93 0 top
LED1  2.74,46.43 90 top
LED2  75.44,3.75 270 top
LED3  2.74,33.99 90 top
LED4  2.74,31.85 90 top
LED5  2.74,29.72 90 top
Q1  8.23,26.01 0 top
R1  53.95,38.15 0 top
R2  5.18,46.43 0 top
R3  54.32,21.23 180 top
R4  7.62,40.54 0 top
R5  55.02,18.44 270 top
R6  25.6,28.19 180 top
R7  7.62,41.61 0 top
R8  9.6,37.8 90 top
R9  4.11,25.45 180 top
R10  12.34,28.96 90 top
R11  2.74,32.92 0 top
R12  2.74,30.78 0 top
R13  2.74,28.65 0 top
R14  51.97,5.49 270 top
R15  54.56,5.49 270 top
R16  57,5.49 270 top
R17  64.62,47.85 270 top
R18  62.18,47.85 270 top
R19  59.59,47.85 270 top
R20  57,47.85 270 top
R21  37.64,47.85 270 top
R22  35.2,47.85 270 top
R23  30.18,47.85 270 top
R24  27.74,47.85 270 top
R25  22.4,47.85 270 top
R26  20.12,47.85 270 top
R27  34.33,5.18 90 top
R28  46.48,44.2 90 top
RESET  5.87,49.68 0 top
SW3  53.95,41.76 90 top
T1  15.54,31.85 270 top
U1  29.92,36.63 0 top
U2  15.57,43.36 270 top
U3  41.91,44.35 270 top
U4  8.38,31.22 90 top

### Tracks (layer width: path | path; a pad name or v marks a point on that pad's centre or on a via)
+3.3V_IF  (via drill 0.2)
  Top 0.152: LED3.A 2.9,33.99 2.74,33.83 2.74,32 2.9,31.85 | 2.9,31.85 LED4.A 3.65,32 5.03,32 5.18,31.85 5.18,31.39 5.64,30.94 6,30.94 U4.29 | 2.9,31.85 2.74,31.7 2.74,29.87 2.9,29.72 LED5.A 3.49,29.58 3.96,29.11 4.42,29.11 v4.87,28.7 | U4.6 9.19,28.86 v9.2,27.85 | v12.34,27.74 R10.1 C11.1 14.02,28.5 14.48,28.96 14.48,30.87 | R9.1 4.61,25.49 4.61,26.29 4.75,26.43 v5.13,26.43 | T1.2 14.48,30.87 | 14.48,30.87 14.48,30.94 17.43,30.94 17.7,31.2 17.7,35.64 17.22,36.12 v17.22,38.56 | v18.9,41.76 18.9,42.98
  Top 0.508: D2.A 24.46,22.63 22.1,24.99 22.1,39.78 18.9,42.98 17.53,44.35 16.91,44.35 U2.5
  Bottom 0.152: 5.18,28.8 8.55,28.8 v9.2,27.85 9.2,27.53 9.3,27.43 10.36,27.43 10.52,27.28 11.89,27.28 v12.34,27.74 | v5.13,26.43 5.14,26.42 6.18,26.42 6.29,26.53 6.29,27.57 5.18,28.68 5.18,28.8 | v4.87,28.7 5.02,28.7 5.18,28.8 | v17.22,38.56 17.22,40.08 v18.9,41.76
+3.3V_TGT  (via drill 0.2, 0.51)
  Top 0.152: R6.1 27.57,28.19 | R5.2 v55.02,17.22 | R2.2 5.64,46.18 6.1,45.72 v6.71,45.72 | U3.3 39.28,43.74 v37.64,43.74 | v45.26,41.45 45.26,42.52 45.19,42.44 U3.5 | R28.2 v46.48,45.57
  Top 0.406: U1.P$3 29.89,32.18 29.89,30.29 29.79,30.29 28.29,28.79 27.61,28.79 27.57,28.75 | 27.57,28.19 27.57,27.04 | R27.2 35.97,5.64 36.73,4.88 v36.73,4.57
  Top 0.508: C1.1 27.57,28.19 27.57,28.75 27.57,28.82 C2.1 28.35,28.83 U1.P$4 U1.P$3 29.9,32.16 27.28,32.16 v26.82,31.7 | 27.57,27.04 26.28,27.04 25.45,26.21 D2.K 25.45,24.08 25.62,23.91 27.51,23.91 C9.1 | D5.K v11.58,17.53 | v18.75,27.89 v18.75,36.58
  Bottom 0.152: v55.02,17.22 55.02,17.07 | v6.71,45.72 6.86,45.72 | 37.34,43.74 v37.64,43.74 39.93,43.74 42.82,46.63 42.82,51.82 43.72,52.63 | v46.48,45.57 46.48,45.87 | 9.43,52.63 6.86,50.14
  Bottom 0.254: 43.72,52.63 9.43,52.63
  Bottom 0.406: v36.73,4.57 36.73,4.27
  Bottom 0.508: v26.82,31.7 26.67,31.55 | v11.58,17.53 12.34,17.53
  pour Bottom: -4.42,55.78 -4.42,-3.51 65.07,-3.66 65.07,55.63
ANT1
  Top 0.203: R1.1 L1.1 | L1.1 C3.1 53.49,35 C4.2 | U1.P$37 49.5,37.32 50.09,36.73 53.29,36.73 L1.1
GND  (via drill 0.2, 0.41, 0.51)
  Top 0.152: C13.2 10.52,40.54 10.52,40.23 11.43,39.32 11.43,37.19 9.6,35.36 8.99,35.36 8.38,35.97 8.38,37.64 6.1,39.93 4.7,39.93 CON1.GND | GPIO1.P$2 77.54,50.63 76.35,51.82 64.92,51.82 | 65.07,51.66 64.92,51.51 64.92,51.82 | C11.2 13.41,31.55 13.11,31.85 15.54,31.85 15.54,32.77 v15.85,33.07 | v15.85,34.44 15.85,34.59 | 64.92,51.82 64.16,52.58 63.86,52.58 | BRD1.29 26.31,50.9 25.15,50.9 24.99,51.05 24.99,52.58
  Top 0.254: 63.7,52.58 63.73,52.58
  Top 0.305: LED2.C 76.87,3.75 74.68,5.94 64.16,5.94 64.01,6.1 | 50.9,5.64 49.99,6.55 49.99,13.56 44.2,13.56 44.2,16.12 U1.P$20 | 24.99,52.58 24.98,52.59 24.98,52.64 24.94,52.68 16.78,52.68 16.32,52.21 C8.2 | 64.92,51.51 64.92,51.79 64.07,52.65 54.76,52.65 54.67,52.56 | 63.7,52.58 54.09,52.58 54,52.66 37.73,52.66 37.64,52.58
  Bottom 0.152: v15.85,33.07 v15.85,34.44
  Bottom 0.305: U4.EXP 5.61,33.99 v5.18,33.99
  other vias: 28.8,27.43 8.38,31.22
  pour Top: -3.51,55.02 -3.35,-2.9 65.07,-2.74 65.07,55.78
GPIO0
  Top 0.152: 51.22,19.66 U1.P$26
  Top 0.305: U1.P$26 52.79,21.23 R3.2
GPIO1  (via drill 0.15, 0.2)
  Top 0.152: U1.P$25 51.28,18.21 53.04,19.96 v55.02,19.96 R5.1 55.47,18.9 55.63,18.75 55.63,18.29 58.66,15.26 v64.67,15.26 | GPIO1.P$1 73.19,49.83 75.25,49.83 75.44,49.64 v75.44,49.53
  Bottom 0.152: 75.44,49.07 v75.44,49.53 79.55,49.53 80.16,48.92 80.16,15.7 79.71,15.24 64.69,15.24 v64.67,15.26
GPIO2  (via drill 0.2)
  Top 0.152: v53.49,9.14 53.49,14.02 51.36,16.16 U1.P$24 | v54.56,7.47 R15.1
  Bottom 0.152: v53.49,9.14 53.49,8.69 53.04,8.23 53.04,8.08 53.49,7.62 54.41,7.62 v54.56,7.47
GPIO3  (via drill 0.2)
  Top 0.152: U1.P$23 52.73,12.93 52.73,8.84 v52.27,8.38 | v57,7.01 R16.1
  Bottom 0.152: v52.27,8.38 52.27,8.99 53.19,9.91 53.49,9.91 56.39,7.01 v57,7.01
HID  (via drill 0.2)
  Top 0.152: v12.13,30.48 11.55,30.97 U4.12 | v4.42,31.44 4.42,31.14 4.27,31.09 3.51,31.09 R12.2
  Bottom 0.152: 11.89,30.63 v12.13,30.48 11.95,30.57 7.98,30.57 7.92,30.63 7.47,31.09 4.88,31.09 v4.42,31.44
I2C0_SCL  (via drill 0.2)
  Top 0.152: v26.82,36.27 24.54,38.56 24.54,42.06 20.12,46.48 R26.2 | v49.99,21.49 51.27,21.49 U1.P$27
  Bottom 0.152: v26.82,36.27 32.92,30.18 49.83,30.18 50.6,29.41 50.6,22.1 v49.99,21.49
I2C0_SDA  (via drill 0.2)
  Top 0.152: U1.P$28 50.18,23.28 49.07,24.38 49.07,28.8 v48.31,29.57 | v25.15,42.37 21.64,45.87 21.64,46.18 22.4,46.94 R25.2
  Bottom 0.152: v48.31,29.57 32.61,29.57 25.6,36.58 25.6,41.91 v25.15,42.37
IF_NRESET
  Top 0.152: U4.2 7.13,28.24 6.73,27.84 4.83,27.84 4.28,27.29 4.28,27.01 4.28,26.58 3.66,25.96 R9.2 C10.1
ISP  (via drill 0.2)
  Top 0.152: U4.1 6.64,28.28 6.52,28.16 4.69,28.16 3.96,27.43 3.66,27.43 v3.2,26.97 | U4.3 7.62,28.85 7.62,28 7.04,27.41 5.88,27.41 5.65,27.18 v5.65,27.13 | v8.53,47.24 8.53,49.12 RESET.P$2 | D6.K 16.31,27.13 v16.31,26.21
  Bottom 0.152: v5.65,27.13 5.49,26.97 4.42,26.97 | 4.42,26.97 v3.2,26.97 2.13,26.97 0.76,28.35 0.76,45.26 1.07,45.57 4.27,45.57 5.18,46.48 7.77,46.48 v8.53,47.24 | v16.31,26.21 16.31,26.97 13.41,26.97 10.52,24.08 5.18,24.08 4.27,24.99 4.27,26.82 4.42,26.97
MSD  (via drill 0.2)
  Top 0.152: R11.2 v4.27,32.92 | U4.7 9.6,28.84 9.6,28.35 10.03,27.96 v10.49,27.97
  Bottom 0.152: v4.27,32.92 3.51,32.16 3.51,29.72 3.96,29.26 10.36,29.26 10.52,29.11 v10.49,27.97
N$1
  Top 0.508: 64.72,26.16 64.62,26.06 C7.2
  Top 1.1: ANT1.P$3 64.72,29.3 64.72,26.16
N$2  (via drill 0.6)
  other vias: 64.52,38.15
N$3  (via drill 0.6)
  other vias: 62.38,38.15
N$4
  Top 0.203: R1.2 L1.2 C3.2 54.41,34.9 C5.2 54.83,34.7 54.79,34.91 | C6.2 61.87,35.66 61.87,35.51
  Top 0.508: 61.87,35.51 61.67,35.31 61.67,34.9
  Top 1.1: ANT1.P$1 64.2,34.9 61.67,34.9 54.79,34.91
N$5  (via drill 0.6)
  other vias: 60.25,38.15
N$6  (via drill 0.6)
  other vias: 58.12,38.15
N$7  (via drill 0.6)
  other vias: 56.29,38.15
N$8  (via drill 0.6)
  other vias: 56.29,36.32
N$9  (via drill 0.6)
  other vias: 56.29,33.27
N$10  (via drill 0.6)
  other vias: 56.29,31.14
N$11  (via drill 0.6)
  other vias: 56.29,29.01
N$12  (via drill 0.6)
  other vias: 56.29,27.18
N$13  (via drill 0.6)
  other vias: 56.29,25.35
N$14  (via drill 0.6)
  other vias: 56.29,23.52
N$15  (via drill 0.6)
  other vias: 58.12,23.52
N$16  (via drill 0.6)
  other vias: 60.25,23.52
N$17  (via drill 0.6)
  other vias: 62.38,23.52
N$18  (via drill 0.6)
  other vias: 64.52,23.52
N$20
  Top 0.152: BRD1.9 50.8,2.95 51.97,4.11 R14.2
N$21  (via drill 0.2)
  Top 0.152: R4.2 C13.1 8.99,39.78 9.6,39.17 R8.2 v10.67,38.25 | U4.14 11.85,31.97 v12.04,32.16
  Bottom 0.152: v12.04,32.16 12.19,32.16 12.65,32.61 12.65,36.58 10.97,38.25 v10.67,38.25
N$22  (via drill 0.3)
  Top 0.305: v56.98,10.53 56.98,13.85 v57.02,13.89 | v55.82,21.22 R3.1 | v73.64,2.21 73.64,3.71 LED2.A
  Bottom 0.305: v57.02,13.89 57.02,20.02 v55.82,21.22 | v56.98,10.53 56.98,10.52 61.55,5.94 72.89,5.94 73.65,5.18 v73.65,2.21 v73.64,2.21
N$23
  Top 0.203: R2.1 LED1.A
N$24  (via drill 0.2)
  Top 0.152: R7.2 C12.1 9.3,41.61 9.45,41.45 9.45,39.78 10.11,39.11 v10.67,39.11 | U4.13 11.99,31.47 v12.18,31.28
  Bottom 0.152: v10.67,39.11 12.95,36.83 12.95,31.7 12.54,31.28 v12.18,31.28
N$25
  Top 0.152: U2.1 14.93,44.31 14.94,44.31
  Top 0.203: 14.74,44.31 14.94,44.31 15.28,44.31 15.54,44.04 15.54,42.67 15.28,42.41 U2.3
  Top 0.406: D3.K 12.73,44.5 D4.K 14.62,44.43 | 14.62,44.43 U2.1 | 14.62,44.43 14.62,44.98 C8.1
N$26
  Top 0.152: U4.15 11.28,32.47 11.73,32.92 14.33,32.92 T1.1
N$27  (via drill 0.2)
  Top 0.152: T1.3 16.64,33.19 16.15,33.68 11.89,33.68 v11.73,33.53 | v9.75,36.58 9.75,37.19 R8.1
  Bottom 0.152: v11.73,33.53 11.73,35.51 10.67,36.58 v9.75,36.58
N$28
  Top 0.152: U4.9 10.79,29.41 10.97,29.41 11.02,29.46 12.13,29.46 12.18,29.41 R10.2
N$29
  Top 0.152: BRD1.10 53.34,3.05 54.56,4.27 R15.2
N$30
  Top 0.152: BRD1.11 55.88,3.3 57,4.42 R16.2
N$31
  Top 0.152: R17.1 64.16,48.31 63.55,48.92 63.55,50.75 BRD1.15
N$32
  Top 0.152: R18.1 61.57,48.31 60.96,48.92 BRD1.16
N$33
  Top 0.152: R19.1 58.42,49.48 BRD1.17
N$34
  Top 0.152: R11.1 2.29,33.69 LED3.C
N$35
  Top 0.152: R12.1 2.29,31.56 LED4.C
N$36
  Top 0.152: R13.1 2.29,29.43 LED5.C
N$37
  Top 0.152: U4.5 8.63,27.54 Q1.P$3 10.54,26.85 C15.1
N$38  (via drill 0.51)
  Top 0.508: D1.K 11.28,42.75 11.28,40.23 12.04,39.47 19.35,39.47 20.57,38.25 v20.57,21.49 | BRD1.5 38.1,4.57 36.12,6.71 v34.34,6.71
  Bottom 0.508: v34.34,6.71 20.57,20.42 v20.57,21.49
N$39
  Top 0.152: R20.1 55.88,49.43 BRD1.18
N$40
  Top 0.152: U4.4 8.13,25.96 7.32,25.15 7.11,25.15 | 7.11,25.15 6.86,25.15 6.71,24.99 C14.1 | 7.11,25.15 Q1.P$1
N$41
  Top 0.152: R21.1 36.58,49.38 BRD1.25
N$42
  Top 0.152: R22.1 34.04,49.48 BRD1.26
N$43
  Top 0.152: R23.1 31.5,49.63 BRD1.27
N$44
  Top 0.152: R24.1 28.96,49.53 BRD1.28
N$45
  Top 0.152: R25.1 21.34,49.38 BRD1.31
N$46
  Top 0.152: R26.1 18.8,49.63 BRD1.32
N$47
  Top 0.508: CON2.1 7.58,13.11 7.54,13.14 D5.A
N$48
  Top 0.152: C17.2 42.21,40.63 42.21,42.98 42.95,43.71 U3.6 44.54,43.74 R28.1
N$49
  Top 0.406: R27.1 35.51,4.72 35.66,4.57 35.66,2.64 BRD1.4
  Bottom 0.406: BRD1.2 30.48,4.72 35.66,4.72 35.66,2.64 BRD1.4
N$50  (via drill 0.2)
  Top 0.152: SW3.6 53.95,44.35 54.71,45.11 61.72,45.11 v62.48,44.35 | v65.53,47.4 R17.2
  Bottom 0.152: v65.53,47.4 65.68,47.24 65.68,45.87 65.53,45.72 62.79,45.72 62.48,45.42 v62.48,44.35
N$51
  Top 0.152: SW3.2 50.69,44.26 50.14,44.81 50.14,47.09 51.51,48.46 54.86,48.46 54.86,48.45 55.44,47.85 55.46,47.85 61.11,47.85 61.57,47.4 R18.2
P5V-VIN  (via drill 0.51)
  Top 0.508: v22.86,21.03 22.86,22.86 21.34,24.38 21.34,39.32 20.42,40.23 12.65,40.23 12.34,40.54 12.34,41.68 D4.A | v37.8,8.69 43.13,8.69 45.72,6.1 BRD1.8
  Bottom 0.508: v22.86,21.03 22.86,19.35 33.53,8.69 v37.8,8.69
P5V_USB
  Top 0.406: CON1.VBUS 8.08,42.6 D1.A D3.A 8.53,44.5 8.53,45.57 9.3,46.33 C16.1
RFU2  (via drill 0.2)
  Top 0.152: U1.P$6 29.43,26.84 v28.8,26.21 | v24.99,26.97 24.99,28.04 R6.2
  Bottom 0.152: v28.8,26.21 25.76,26.21 v24.99,26.97
SPI_MISO  (via drill 0.2)
  Top 0.152: U1.P$12 23.77,16.15 v23.01,16.92 | v19.51,19.81 v19.51,37.64 | U3.8 43.97,46.25 42.37,47.85 30.78,47.85 30.33,47.4 R23.2 v30.18,46.48
  Bottom 0.152: v19.51,37.64 19.66,37.8 19.66,43.59 21.79,45.72 29.87,45.72 30.18,46.02 v30.18,46.48 | v23.01,16.92 22.4,16.92 v19.51,19.81
SPI_MOSI  (via drill 0.2)
  Top 0.152: U1.P$11 29.82,17.83 26.06,17.83 24.69,19.2 v24.69,20.73 | v23.93,28.19 23.93,34.14 25.15,35.36 27.28,35.36 28.35,36.42 v28.35,40.23 | U3.1 39.23,46.33 35.51,46.33 35.2,46.63 | 35.2,46.63 R22.2 | 35.2,46.63 34.07,45.5 v30.48,45.5
  Bottom 0.152: v24.69,20.73 24.38,21.03 24.38,26.37 23.93,26.82 v23.93,28.19 | v28.35,40.23 28.35,41.61 28.35,41.76 28.35,43.37 v30.48,45.5
SPI_NSS  (via drill 0.2)
  Top 0.152: U1.P$9 29.88,21.5 29.11,20.73 v27.13,20.73 | v23.62,34.59 23.62,41.3 v23.93,41.61 | v26.37,43.74 v32.61,43.74 32.61,43.13 33.38,42.37 39.23,42.37 U3.4 41.07,42.44 41.15,42.52 41.15,46.79 40.54,47.4 R21.2
  Bottom 0.152: v27.13,20.73 29.11,20.73 29.87,21.49 29.87,30.78 26.06,34.59 v23.62,34.59 | v23.93,41.61 23.93,41.91 25.76,43.74 v26.37,43.74 | v32.61,43.74 33.22,43.74
SPI_SCK  (via drill 0.2)
  Top 0.152: U1.P$10 28.25,19.72 v28.19,19.66 | v23.32,42.06 23.01,41.76 v23.01,29.72 v23.01,25.76 | v24.23,46.48 24.08,46.33 v24.08,44.96 39.28,44.96 U3.2 | v27.74,46.48 R24.2
  Bottom 0.152: v28.19,19.66 24.69,19.66 23.77,20.57 23.77,21.95 22.71,23.01 22.71,25.45 v23.01,25.76 | v23.32,42.06 23.47,42.06 23.47,44.35 v24.08,44.96 | v24.23,46.48 v27.74,46.48
TGT_NRESET  (via drill 0.2)
  Top 0.152: U4.8 10.91,28.87 11.43,28.35 11.43,27.74 12.12,27.05 | U1.P$33 50.09,32.18 v50.07,32.16 | v49.07,12.8 v49.07,4.27 | v31.39,7.77 33.07,6.1 33.07,2.59 BRD1.3 | 12.12,27.05 18.14,21.03 18.14,19.35 v20.27,17.22 | 12.12,27.05 12.12,27.13 12.95,27.13 D6.A 13.72,27.13
  Bottom 0.152: v50.07,32.16 50.07,31.47 51.21,30.33 51.21,21.18 50.6,20.57 49.83,20.57 49.23,19.96 49.23,12.95 v49.07,12.8 | v49.07,4.27 49.07,3.35 46.48,0.76 33.07,0.76 33.07,2.49 BRD1.3 33.07,2.59 | v31.39,7.77 23.16,16 21.49,16 v20.27,17.22
TGT_RX  (via drill 0.2)
  Top 0.152: U1.P$16 36.57,16.16 35.51,17.22 31.85,17.22 31.39,17.68 31.39,30.78 32.16,31.55 32.16,32.61 31.55,33.22 31.55,34.14 30.78,34.9 26.67,34.9 v25.6,33.83 | U4.32 4.88,29.47 v4.45,29.8
  Bottom 0.152: v4.45,29.8 11.59,29.74 11.93,29.39 21.16,29.39 v25.6,33.83
TGT_SWCLK  (via drill 0.2)
  Top 0.152: U1.P$29 50.25,25.06 v49.94,25.04 | v14.02,34.59 11.73,34.59 10.82,33.68 10.82,33.06 U4.16
  Bottom 0.152: 49.78,25.04 v49.94,25.04 49.83,25.15 49.83,25.3 46.33,28.8 32.31,28.8 25.91,35.2 14.63,35.2 v14.02,34.59
TGT_SWDIO  (via drill 0.2)
  Top 0.152: U1.P$30 50.51,26.84 v49.89,26.82 | U4.17 10.13,33.91 11.73,35.51 v13.87,35.51
  Bottom 0.152: v49.89,26.82 48.77,26.82 46.48,29.11 32.46,29.11 26.06,35.51 v13.87,35.51
TGT_TX  (via drill 0.2)
  Top 0.152: U1.P$15 35.26,16.55 34.9,16.92 31.7,16.92 31.09,17.53 31.09,30.94 31.85,31.7 31.85,32.46 31.24,33.07 31.24,33.99 30.63,34.59 27.43,34.59 26.06,33.22 25.76,32.92 v24.84,32 | U4.31 5.54,29.97 5.33,30.18 5.33,30.33 5.03,30.63 v4.58,30.61 | v16.46,28.65 16.46,29.87 v16.31,30.02
  Bottom 0.152: v4.58,30.61 7.47,30.63 7.77,30.33 7.87,30.23 11.55,30.23 11.89,29.88 16.16,29.88 v16.31,30.02 | v24.84,32 24.23,32 21.18,28.96 16.76,28.96 v16.46,28.65
UART  (via drill 0.2)
  Top 0.152: v8.08,34.9 8.13,34.84 U4.21 | R13.2 3.88,28.65 v3.99,28.54
  Bottom 0.152: v8.08,34.9 3.2,34.9 2.74,34.44 2.74,28.96 3.04,28.55 v3.99,28.54
UART1_CTS  (via drill 0.2)
  Top 0.152: U1.P$32 53.56,30.4 v54.25,31.09 | v59.59,46.48 R19.2
  Bottom 0.152: v54.25,31.09 54.25,41.91 58.83,46.48 v59.59,46.48
UART1_RTS  (via drill 0.2)
  Top 0.152: U1.P$31 53.15,28.62 v53.49,28.96 | v57,46.48 R20.2
  Bottom 0.152: v53.49,28.96 53.49,41.61 57.91,46.02 57.45,46.48 v57,46.48
UART1_RX  (via drill 0.2)
  Top 0.152: U1.P$14 33.84,15.8 34.3,15.8 34.75,15.35 36.14,15.35 36.46,15.04 37.22,15.04 37.99,14.21 38.33,13.87 v38.4,13.87 | 51.51,46.72 51.51,47.24 52.43,48.16 54.62,48.16 55.17,47.61 55.17,46.94 56.39,45.72 63.4,45.72 64.47,46.79 66.9,46.79 v67.06,46.63 | 51.51,46.63 51.51,46.72 | 51.51,46.72 SW3.3 52.73,45.58 52.73,42.82 53.8,41.76 SW3.5
  Bottom 0.152: v38.4,13.87 40.69,11.58 59.59,11.58 63.86,15.85 79.25,15.85 79.86,16.46 79.86,46.79 79.1,47.55 69.8,47.55 68.88,46.63 v67.06,46.63
UART1_TX  (via drill 0.2)
  Top 0.152: U1.P$13 32.17,15.69 32.59,15.69 32.86,15.42 33.86,15.42 34.3,14.97 35.26,14.97 36.04,14.19 37.17,13.05 40.72,13.05 v40.75,13.02 | v67.06,45.87 64.31,45.87 63.86,45.42 55.29,45.42 SW3.7 53.9,46.71 v53.9,45.59 | SW3.1 v51.55,40.56 v51.54,40.55
  Bottom 0.152: v40.75,13.02 41.88,11.89 59.28,11.89 63.55,16.15 79.1,16.15 79.55,16.61 79.55,46.63 78.94,47.24 69.95,47.24 68.58,45.87 v67.06,45.87 | v51.54,40.55 51.54,43.83 53.28,45.57 53.88,45.57 v53.9,45.59
USB_D+
  Top 0.152: R4.1 7.01,40.54 6.25,41.3 CON1.D+
USB_D-
  Top 0.152: CON1.D- 6.36,41.95 6.71,41.61 R7.1
WAKE  (via drill 0.2)
  Top 0.152: v52.88,32.16 52.88,32.77 52.47,32.77 U1.P$34 | v53.19,18.9 53.04,18.9 51.97,17.83 51.97,17.53 51.66,17.22 50.44,17.22 50.14,17.53 49.07,17.53 48.62,17.07 48.62,15.09 48.92,14.78 50.29,14.78 52.43,12.65 52.43,9.75 v51.36,8.69 | v51.97,7.01 R14.1
  Bottom 0.152: v52.88,32.16 52.88,27.13 54.1,25.91 54.1,19.66 53.95,19.66 v53.19,18.9 | v51.36,8.69 51.36,7.62 v51.97,7.01

### Text on the board
tPlace: I2C_SCL / I2C_SDA / / GND / SPI_SCK / SPI_MISO / SPI_MOSI / SPI_NSS | UART_RTS / UART_CTS / UART_TX / UART_RX | OFF ON | 3V | BATTERY / USB / RESET / DAPLINK | XDOT MCU / FLASH MEMORY / UART SWAP / LORA ANTENNA | github.com/ARMmbed/mbed-HDK | mbed-xDOT-shield v1.1.0 | LED1 | 3V3 / nRESET / 3V3 / 5V / GND / GND / VIN | WAKE / GPIO2 / GPIO3